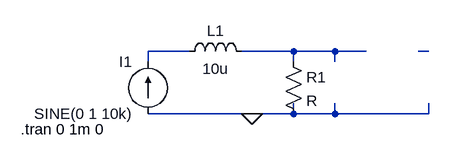
[diagram p0: schematic blah.asc]
blah.asc, the LTspice schematic file:
Version 4
SHEET 1 880 680
WIRE 240 160 176 160
WIRE 400 160 320 160
WIRE 464 160 400 160
WIRE 512 160 464 160
WIRE 608 160 592 160
WIRE 176 176 176 160
WIRE 400 176 400 160
WIRE 464 176 464 160
WIRE 336 256 176 256
WIRE 400 256 400 240
WIRE 400 256 336 256
WIRE 464 256 464 240
WIRE 464 256 400 256
WIRE 608 256 608 240
WIRE 608 256 464 256
FLAG 336 256 0
SYMBOL current 176 256 R180
WINDOW 0 24 80 Left 2
WINDOW 3 24 0 Left 2
WINDOW 123 0 0 Left 2
WINDOW 39 0 0 Left 2
SYMATTR InstName I1
SYMATTR Value SINE(0 1 10k)
SYMBOL ind 224 176 R270
WINDOW 0 32 56 VTop 2
WINDOW 3 5 56 VBottom 2
SYMATTR InstName L1
SYMATTR Value 10u
SYMBOL res 384 160 R0
SYMATTR InstName R1
TEXT -20 280 Left 2 !.tran 0 1m 0

The netlist it stands for:
* blah.asc
I1 0 N001 SINE(0 1 10k)
L1 N001 N002 10u
R1 N002 0 R
.tran 0 1m 0
.backanno
.end